# EAGLE design uC_dev_board (EAGLE 9.6.2)
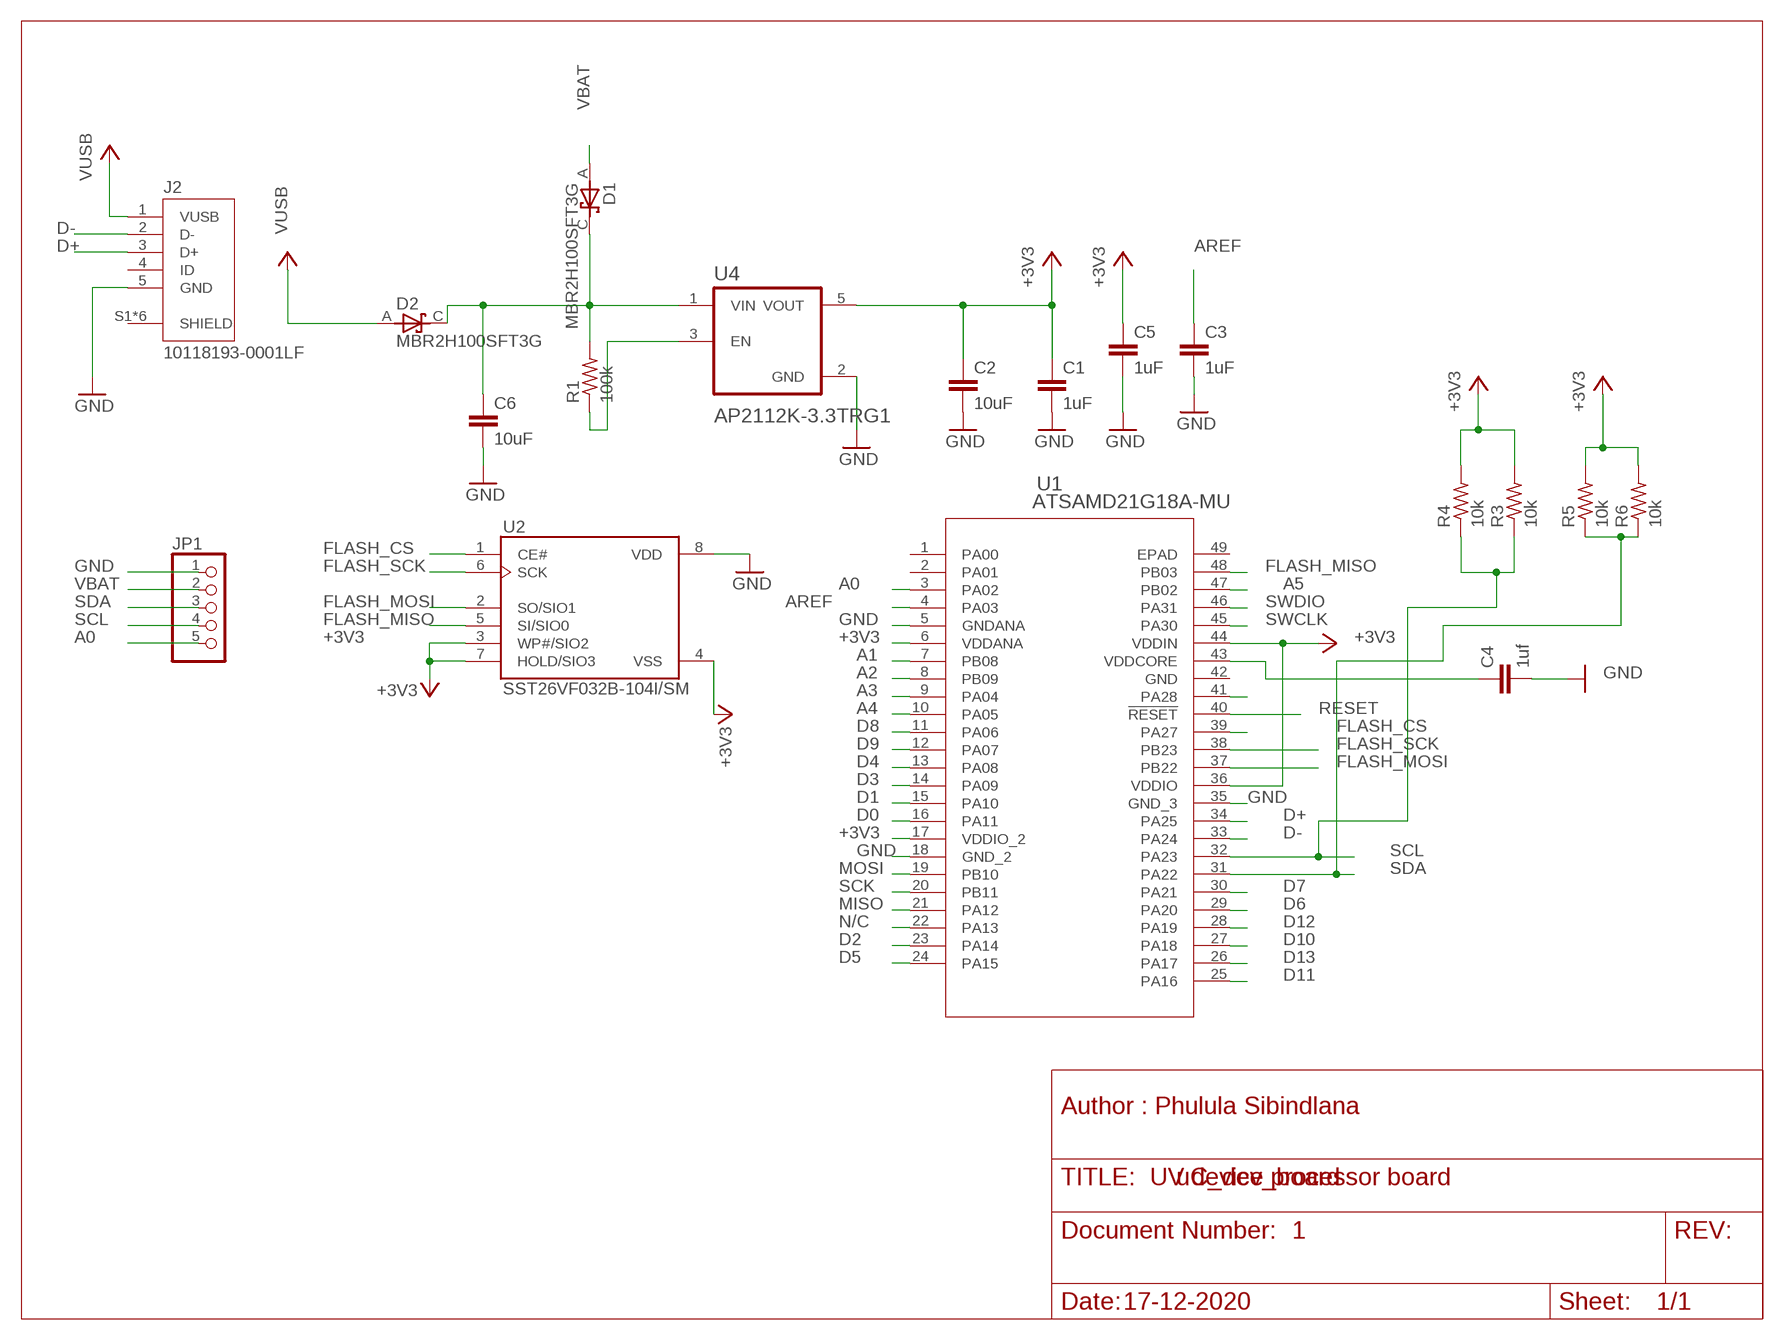
[diagram p0: schematic, sheet 1]

## Parts
C1  1uF  C-EUC0805  [C0805]
C2  10uF  C-EUC0805  [C0805]
C3  1uF  C-EUC0805  [C0805]
C4  1uf  C-EUC0805  [C0805]
C5  1uF  C-EUC0805  [C0805]
C6  10uF  C-EUC0805  [C0805]
D1  MBR2H100SFT3G  [SODFL3616X98N]
D2  MBR2H100SFT3G  [SODFL3616X98N]
J2  10118193-0001LF  [FCI_10118193-0001LF]
JP1  PINHD-1X5  [1X05]
R1  100k  R-US_R0603  [R0603]
R3  10k  R-US_R0603  [R0603]
R4  10k  R-US_R0603  [R0603]
R5  10k  R-US_R0603  [R0603]
R6  10k  R-US_R0603  [R0603]
U1  ATSAMD21G18A-MU  [QFN48_7X7MC_MCH]
U2  SST26VF032B-104I/SM  [SOIC127P794X203-8N]
U4  AP2112K-3.3TRG1  [SOT95P285X140-5N]

## Nets
+3V3: C1.1 C2.1 C5.1 R3.2 R4.2 R5.2 R6.2 U1.6(VDDANA) U1.17(VDDIO_2) U1.36(VDDIO) U1.44(VDDIN) U2.3(WP#/SIO2) U2.4(VSS) U2.7(HOLD/SIO3) U4.5(VOUT)
+5V: D2.A J2.1(VUSB) ; supply symbol labelled VUSB
A0: JP1.5 U1.3(PA02)
A1: U1.7(PB08)
A2: U1.8(PB09)
A3: U1.9(PA04)
A4: U1.10(PA05)
A5: U1.47(PB02)
AREF: C3.1 U1.4(PA03)
D0: U1.16(PA11)
D1: U1.15(PA10)
D2: U1.23(PA14)
D3: U1.14(PA09)
D4: U1.13(PA08)
D5: U1.24(PA15)
D6: U1.29(PA20)
D7: U1.30(PA21)
D8: U1.11(PA06)
D9: U1.12(PA07)
D10: U1.27(PA18)
D11: U1.25(PA16)
D12: U1.28(PA19)
D13: U1.26(PA17)
D+: J2.3(D+) U1.34(PA25)
D-: J2.2(D-) U1.33(PA24)
FLASH_CS: U1.39(PA27) U2.1(CE#)
FLASH_MISO: U1.48(PB03) U2.5(SI/SIO0)
FLASH_MOSI: U1.37(PB22) U2.2(SO/SIO1)
FLASH_SCK: U1.38(PB23) U2.6(SCK)
GND: C1.2 C2.2 C3.2 C4.2 C5.2 C6.2 J2.5(GND) JP1.1 U1.5(GNDANA) U1.18(GND_2) U1.35(GND_3) U2.8(VDD) U4.2(GND)
MISO: U1.21(PA12)
MOSI: U1.19(PB10)
N$1: C6.1 D1.C D2.C R1.2 U4.1(VIN)
N$2: R1.1 U4.3(EN)
N$36: U1.41(PA28)
N$39: C4.1 U1.43(VDDCORE)
N/C: U1.22(PA13)
RESET: U1.40(!RESET)
SCK: U1.20(PB11)
SCL: JP1.4 R3.1 R4.1 U1.32(PA23)
SDA: JP1.3 R5.1 R6.1 U1.31(PA22)
SWCLK: U1.45(PA30)
SWDIO: U1.46(PA31)
VBAT: D1.A JP1.2
Unconnected: J2.4(ID) J2.S1(SHIELD) J2.S2(SHIELD) J2.S3(SHIELD) J2.S4(SHIELD) J2.S5(SHIELD) J2.S6(SHIELD) U1.1(PA00) U1.2(PA01) U1.42(GND) U1.49(EPAD)

## Notes on the sheet
- Author : Phulula Sibindlana
- UV device processor board
- 1
- 17-12-2020

## Library data of the parts
C1-C6 = rcl:C-EU: CAPACITOR, European symbol; SPICEPREFIX: C
D1 D2 = MBR2H100SFT3G:MBR2H100SFT3G: MBR2H100 Series 100 V 2 A Surface Mount Schottky Power Rectifier - SOD-123F Check prices <https://pricing.snapeda.com/parts/MBR2H100SFT3G/ON%20Semiconductor/view-part?ref=eda>; AVAILABILITY: Good; DESCRIPTION: Diode Schottky 100V 2A Surface Mount SOD-123FL; MF: ON Semiconductor; MP: MBR2H100SFT3G; PACKAGE: SOD-123FL-2 ON Semiconductor; PRICE: None; PURCHASE-URL: https://pricing.snapeda.com/search/part/MBR2H100SFT3G/?ref=eda
J2 = 10118193-0001LF:10118193-0001LF: Micro USB B Type Receptacle Check prices <https://pricing.snapeda.com/parts/10118193-0001LF/FCI/view-part?ref=eda>; AVAILABILITY: Good; DESCRIPTION: USB - micro B USB 2.0 Receptacle Connector 5 Position Surface Mount, Right Angle; Through Hole; MF: FCI; MP: 10118193-0001LF; PACKAGE: None; PRICE: None; PURCHASE-URL: https://pricing.snapeda.com/search/part/10118193-0001LF/?ref=eda
JP1 = pinhead:PINHD-1X5: PIN HEADER
R1 R3-R6 = rcl:R-US_: RESISTOR, American symbol; SPICEPREFIX: R
U1 = untitled:ATSAMD21G18A-MU; BUILT_BY: EMA_Molly; COPYRIGHT: Copyright (C) 2018 Accelerated Designs. All rights reserved; MANUFACTURER_PART_NUMBER: ATSAMD21G18A-MU; SOURCELIBRARY: Microchip_2019-08-23_25; VENDOR: Microchip
U2 = SST26VF032B-104I_SM:SST26VF032B-104I/SM: SST26VF032 Series 32 Mb (4M x 8) 3.6 V Serial Quad I/O Flash Memory - SOIJ-8; AVAILABILITY: Unavailable; DESCRIPTION: FLASH Memory IC 32Mb (4M x 8) SPI - Quad I/O 104MHz 8-SOIJ; MF: Microchip; MP: SST26VF032B-104I/SM; PACKAGE: SO-8 Microchip; PRICE: None
U4 = AP2112K-3.3TRG1:AP2112K-3.3TRG1: AP2112 Series 0.6 A 3.3 V Fixed Output SMT LDO Linear Regulator - SOT23-5 Check prices <https://pricing.snapeda.com/parts/AP2112K-3.3TRG1/Diodes%20Inc./view-part?ref=eda>; AVAILABILITY: Good; DESCRIPTION: Linear Voltage Regulator IC 1 Output 600mA SOT-25; MF: Diodes Inc.; MP: AP2112K-3.3TRG1; PACKAGE: SOT-753 Diodes Inc.; PRICE: None; PURCHASE-URL: https://pricing.snapeda.com/search/part/AP2112K-3.3TRG1/?ref=eda

## Board
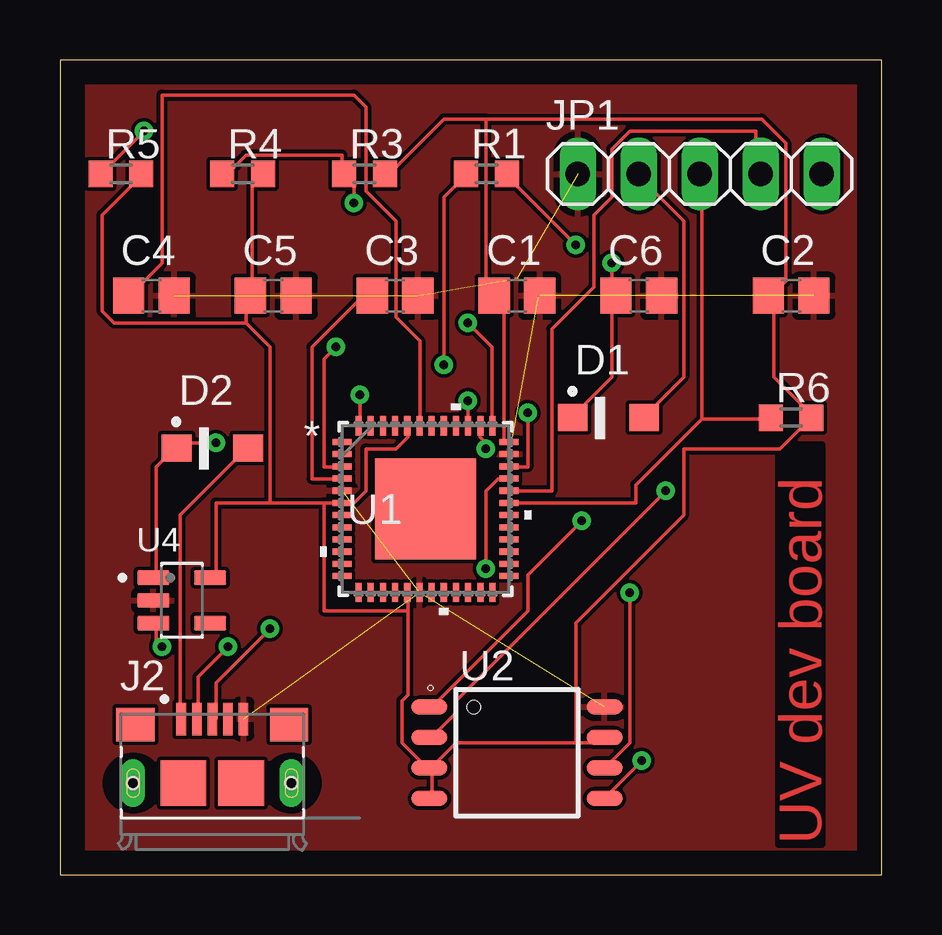
[diagram p1: board, top side]
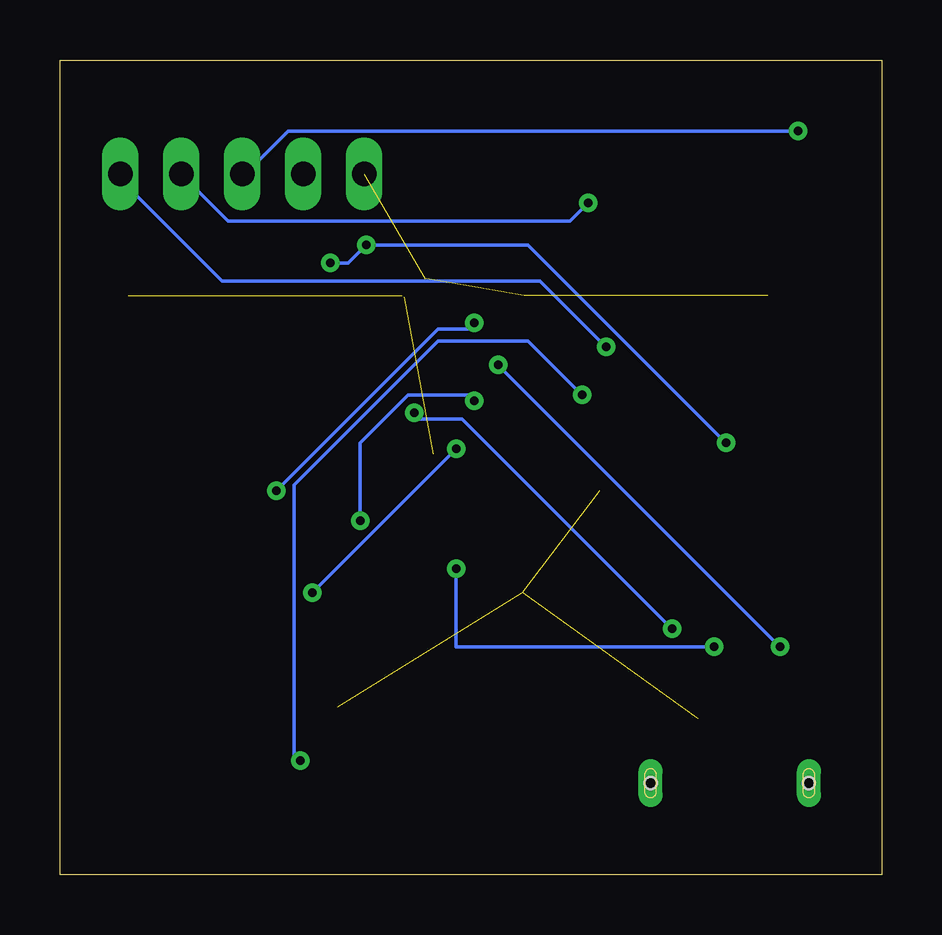
[diagram p2: board, bottom side, seen from below]

Size 34.27 x 33.96 mm. Coordinates in mm from the lower left corner, seen from the top.
Outline: 0,0 34.27,0 34.27,33.96 0,33.96 0,0
Copper layers (1*16): Top 0.035mm / dielectric 1.5mm / Bottom 0.035mm
Design rules "default": minimum track width 6mil, minimum drill 0.35mm, track to track 6mil, track to pad 6mil, pad to pad 6mil, via to via 6mil, smd to smd 6mil, copper to edge 40mil, drill to drill 6mil, minimum pad ring 10mil, minimum via ring 8mil, stop-mask expansion 4mil, vias tented up to drill 0mil, thermal gap 10mil

### Footprints (pad centres in the part's own frame; a part is rotated, then mirrored left to right if it is on the bottom)
C0805 = smd 1.3 x 1.5: 1 -0.95,0; 2 0.95,0
SODFL3616X98N = smd 1.24 x 1.12: A 1.49,0; C -1.49,0
FCI_10118193-0001LF = smd 0.4 x 1.35: 1 -1.3,2.675; 2 -0.65,2.675; 3 0,2.675; 4 0.65,2.675; 5 1.3,2.675 | smd 1.6 x 1.4: S1 -3.2,2.45; S2 3.2,2.45 | smd 1.9 x 1.9: S3 1.2,0; S4 -1.2,0 | drill 0.5 pad 0.9 long: S5 -3.3,0; S6 3.3,0 | hole 0.5: -3.3,0; 3.3,0
1X05 = drill 1.016 long: 1 -5.08,0; 2 -2.54,0; 3 0,0; 4 2.54,0; 5 5.08,0
R0603 = smd 1 x 1.1: 1 -0.85,0; 2 0.85,0
QFN48_7X7MC_MCH = smd 0.808 x 0.255: 1 -3.477,2.794; 2 -3.477,2.286; 3 -3.477,1.778; 4 -3.477,1.27; 5 -3.477,0.762; 6 -3.477,0.254; 7 -3.477,-0.254; 8 -3.477,-0.762; 9 -3.477,-1.27; 10 -3.477,-1.778; 11 -3.477,-2.286; 12 -3.477,-2.794; 25 3.477,-2.794; 26 3.477,-2.286; 27 3.477,-1.778; 28 3.477,-1.27; 29 3.477,-0.762; 30 3.477,-0.254; 31 3.477,0.254; 32 3.477,0.762; 33 3.477,1.27; 34 3.477,1.778; 35 3.477,2.286; 36 3.477,2.794 | smd 0.255 x 0.808: 13 -2.794,-3.477; 14 -2.286,-3.477; 15 -1.778,-3.477; 16 -1.27,-3.477; 17 -0.762,-3.477; 18 -0.254,-3.477; 19 0.254,-3.477; 20 0.762,-3.477; 21 1.27,-3.477; 22 1.778,-3.477; 23 2.286,-3.477; 24 2.794,-3.477; 37 2.794,3.477; 38 2.286,3.477; 39 1.778,3.477; 40 1.27,3.477; 41 0.762,3.477; 42 0.254,3.477; 43 -0.254,3.477; 44 -0.762,3.477; 45 -1.27,3.477; 46 -1.778,3.477; 47 -2.286,3.477; 48 -2.794,3.477 | smd 4.191 x 4.191: 49 0,0
SOIC127P794X203-8N = smd 1.5 x 0.65: 1 -3.65,1.905; 2 -3.65,0.635; 3 -3.65,-0.635; 4 -3.65,-1.905; 5 3.65,-1.905; 6 3.65,-0.635; 7 3.65,0.635; 8 3.65,1.905
SOT95P285X140-5N = smd 1.35 x 0.6: 1 -1.185,0.95; 2 -1.185,0; 3 -1.185,-0.95; 4 1.185,-0.95; 5 1.185,0.95

### Placement (x,y rotation side)
C1  19.05,24.13 0 top
C2  30.48,24.13 0 top
C3  13.97,24.13 0 top
C4  3.81,24.13 0 top
C5  8.89,24.13 0 top
C6  24.13,24.13 0 top
D1  22.86,19.05 0 top
D2  6.35,17.78 0 top
J2  6.35,3.81 0 top
JP1  26.67,29.21 0 top
R1  17.78,29.21 0 top
R3  12.7,29.21 0 top
R4  7.62,29.21 0 top
R5  2.54,29.21 0 top
R6  30.48,19.05 0 top
U1  15.24,15.24 0 top
U2  19.05,5.08 0 top
U4  5.08,11.43 0 top

### Tracks (layer width: path | path; a pad name or v marks a point on that pad's centre or on a via)
+3V3
  Top 0.152: U1.36 18.5,18 18.5,23.75 18.25,24 C1.1 18,24.25 17.75,24.5 17.75,31.5 | 17.75,31.5 16,31.5 13.75,29.25 R3.2 | 17.75,31.5 29.25,31.5 30.25,30.5 30.25,24.75 29.75,24.25 C2.1 29.75,24 29.75,20.75 31.25,19.25 R6.2 31.25,19 30,17.75 26,17.75 26,15 21.5,10.5 21.5,5.5 | 14.5,11 14.5,7.5 14.25,7.25 14.25,5.5 15.25,4.5 U2.3 | 14.5,11 14.5,11.75 U1.17 | U2.4 15.5,3.25 15.5,4.25 U2.3 | 21.5,5.5 16.5,5.5 15.5,4.5 U2.3 | 21.5,5.5 22.5,5.5 U2.7 | 7.75,23 2.25,23 1.75,23.5 1.75,27.5 3.25,29 R5.2 | 7.75,23 7.75,24 C5.1 8,24.25 8,28.75 8.25,29 R4.2 | 8.75,15.5 6.5,15.5 6.5,12.5 U4.5 | 8.75,15.5 11,15.5 | 11,15.5 U1.6 12,15.5 12.25,15.5 12.75,16 12.75,17.75 14,17.75 14.5,18.25 14.5,18.5 U1.44 | 7.75,23 8.75,22 8.75,15.5 | 14.5,11 11,11 11,15.5
+5V
  Top 0.152: D2.A 7.75,17.75 5,15 5,6.5 J2.1
A0  (via drill 0.35)
  Top 0.152: v11.5,22 11,21.5 11,17 11.75,17 U1.3
  Bottom 0.152: v11.5,22 14.25,24.75 27.5,24.75 31.75,29 JP1.5
AREF
  Top 0.152: U1.4 10.5,16.5 10.5,22 12.5,24 13,24 C3.1
D+  (via drill 0.35)
  Top 0.152: v19.5,19.25 19.5,17 18.75,17 U1.34 | v8.75,10.25 6.5,8 6.5,6.5 J2.3
  Bottom 0.152: v19.5,19.25 19.25,19 17.5,19 v8.75,10.25
D-  (via drill 0.35)
  Top 0.152: v17.75,12.75 17.75,16 18.25,16.5 18.5,16.5 U1.33 | v7,9.5 5.75,8.25 5.75,6.5 J2.2
  Bottom 0.152: v17.75,12.75 17.75,9.5 v7,9.5
FLASH_CS  (via drill 0.35)
  Top 0.152: v17,19.75 17,18.75 U1.39 | v21.75,14.75 19.5,12.5 19.5,11 15.5,7 U2.1
  Bottom 0.152: v17,19.75 17.25,20 19.75,20 21.75,18 v21.75,14.75
FLASH_MISO  (via drill 0.35)
  Top 0.152: v12.5,20 12.5,18.75 U1.48 | v24.25,4.75 22.75,3.25 U2.5
  Bottom 0.152: v12.5,20 14.75,22.25 18.5,22.25 24.5,16.25 24.5,4.75 v24.25,4.75
FLASH_MOSI  (via drill 0.35)
  Top 0.152: v17,23 18,22 18,18.75 U1.37 | v25.25,16 16.5,7.25 16.5,6.75 15.5,5.75 U2.2
  Bottom 0.152: v17,23 17.25,22.75 18.5,22.75 v25.25,16
FLASH_SCK  (via drill 0.35)
  Top 0.152: v17.75,17.75 17.75,18 17.5,18.25 17.5,18.5 U1.38 | v23.75,11.75 23.75,5.5 22.75,4.5 U2.6
  Bottom 0.152: v23.75,11.75 v17.75,17.75
GND  (10 unrouted)
  Top 0.152: C1.2 19.96,24.08 19.92,24.08 | 19.05,24.84 19.02,24.84
  pour Top: 0,34.29 34.29,34.29 34.29,0 0,0
N$1  (via drill 0.35)
  Top 0.152: U4.1 4,12.5 4,17 4.75,17.75 D2.C 5,18 v6.5,18 | v21.5,26.25 18.75,29 R1.2 | v23,25.5 23,24.25 23.01,24.23 23.16,24.23 C6.1 23.16,24.08 23.01,23.93 23,23.93 | 23,24 23,23.93 | 23,23.93 23,20.75 21.5,19.25 D1.C
  Bottom 0.152: v23,25.5 22.25,25.5 v21.5,26.25 14.75,26.25 v6.5,18
N$2  (via drill 0.35)
  Top 0.152: v16,21.25 16,28.25 16.75,29 R1.1 | v4.25,9.5 4,9.75 4,10.25 U4.3
  Bottom 0.152: v4.25,9.5 v16,21.25
N$39
  Top 0.152: U1.43 15,18.75 15,22.25 14,23.25 14,27.25 12.75,28.5 12.75,32 12.25,32.5 4.25,32.5 4.25,25.5 3,24.25 C4.1
SCL  (via drill 0.35)
  Top 0.152: R4.1 7,29.25 7.75,30 11.75,30 11.75,29.25 R3.1 12,29 12.25,28.75 v12.25,28 | U1.32 18.75,16 20.5,16 20.5,22.75 22.25,24.5 22.25,27.5 23,28.25 23,30.25 23.75,31 29,31 29,29.25 JP1.4
  Bottom 0.152: v12.25,28 13,27.25 27.25,27.25 JP1.4
SDA  (via drill 0.35)
  Top 0.152: 26.75,19 24,16.25 24,15.5 18.75,15.5 U1.31 | 26.75,19 29.5,19 R6.1 | v3.5,31 1.75,29.25 R5.1 | 26.75,19 26.75,29 JP1.3
  Bottom 0.152: v3.5,31 24.75,31 26.5,29.25 JP1.3
VBAT
  Top 0.152: D1.A 24.5,19.25 26,20.75 26,27.25 24.25,29 JP1.2

### Text on the board
Top: UV dev board